# Altium schematic sheet Sheet1.SchDoc
size A
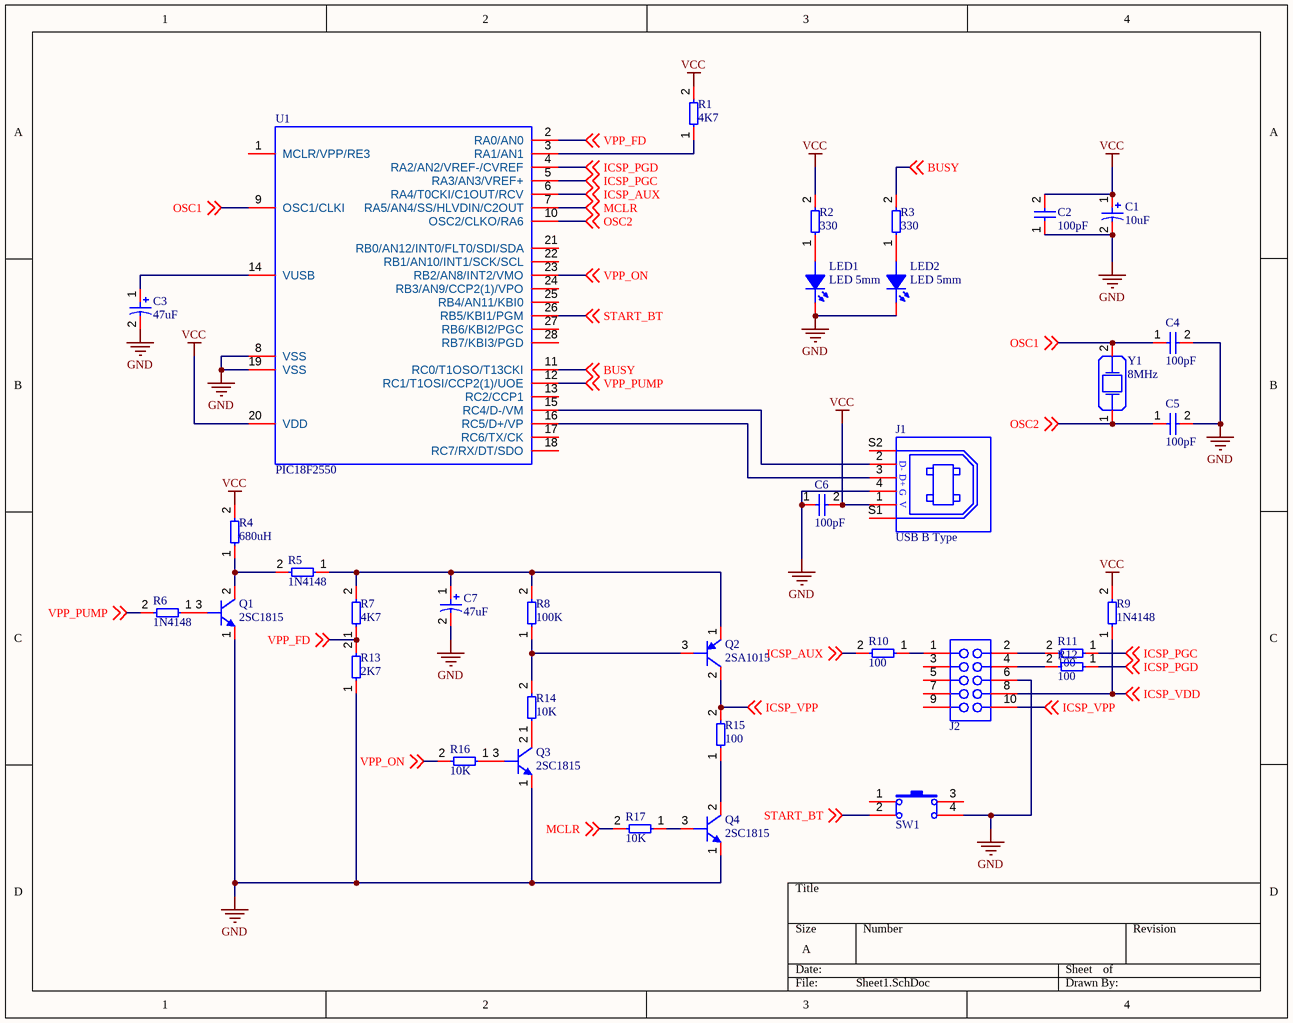
[diagram p0: Sheet1.SchDoc]

## Parts
C1  10uF  [CAP_RAD_4mm]
C2  100pF  [CAP_DISC_PITCH_2.54MM]
C3  47uF  [CAP_RAD_4mm]
C4  100pF  [CAP_DISC_PITCH_2.54MM]
C5  100pF  [CAP_DISC_PITCH_2.54MM]
C6  100pF  [CAP_DISC_PITCH_2.54MM]
C7  47uF  [CAP_RAD_4mm]
J1  USB B Type  [USB-B-TYPE]
J2  Header 5x2 TH Pitch 2.54mm  [Header 5x2 TH Pitch 2.54mm]  (value not drawn)
LED1  LED 5mm  [LED_5MM]
LED2  LED 5mm  [LED_5MM]
Q1  2SC1815  [TO-92]
Q2  2SA1015  [TO-92]
Q3  2SC1815  [TO-92]
Q4  2SC1815  [TO-92]
R1  4K7  [RES-0.25W-H-MF]
R2  330  [RES-0.25W-H-MF]
R3  330  [RES-0.25W-H-MF]
R4  680uH  [RES-0.5W-HH-MF]
R5  1N4148  [RES-0.25W-H-MF]
R6  1N4148  [RES-0.25W-H-MF]
R7  4K7  [RES-0.25W-H-MF]
R8  100K  [RES-0.25W-H-MF]
R9  1N4148  [RES-0.25W-H-MF]
R10  100  [RES-0.25W-H-MF]
R11  100  [RES-0.25W-H-MF]
R12  100  [RES-0.25W-H-MF]
R13  2K7  [RES-0.25W-H-MF]
R14  10K  [RES-0.25W-H-MF]
R15  100  [RES-0.25W-H-MF]
R16  10K  [RES-0.25W-H-MF]
R17  10K  [RES-0.25W-H-MF]
SW1  Button Hole  [BUTTON_HOLE_5.0mm]  (value not drawn)
U1  PIC18F2550  [DIP28_M04]
Y1  8MHz  [HC-49S]

## Nets
GND: C1.2 C2.1 C3.2 C4.2 C5.2 C6.1 C7.2 J1.4 J2.6 LED1.2(K) LED2.2(K) Q1.1(E) Q3.1(E) Q4.1(E) R13.1 SW1.4 U1.8(VSS) U1.19(VSS)
VCC: C1.1 C2.2 C6.2 J1.1 R1.2 R2.2 R4.2 R9.2 U1.20(VDD)
BUSY: R3.2 U1.11(RC0/T1OSO/T13CKI) ; off-sheet BUSY
ICSP_AUX: R10.2 U1.6(RA4/T0CKI/C1OUT/RCV) ; off-sheet ICSP_AUX
ICSP_PGC: R11.1 U1.5(RA3/AN3/VREF+) ; off-sheet ICSP_PGC
ICSP_PGD: R12.1 U1.4(RA2/AN2/VREF-/CVREF) ; off-sheet ICSP_PGD
ICSP_VDD: J2.8 R9.1 ; off-sheet ICSP_VDD
ICSP_VPP: J2.10 Q2.2(C) R15.2 ; off-sheet ICSP_VPP
MCLR: R17.2 U1.7(RA5/AN4/SS/HLVDIN/C2OUT) ; off-sheet MCLR
OSC1: C4.1 U1.9(OSC1/CLKI) Y1.2 ; off-sheet OSC1
OSC2: C5.1 U1.10(OSC2/CLKO/RA6) Y1.1 ; off-sheet OSC2
START_BT: SW1.2 U1.26(RB5/KBI1/PGM) ; off-sheet START_BT
VPP_FD: R7.1 R13.2 U1.2(RA0/AN0) ; off-sheet VPP_FD
VPP_ON: R16.2 U1.23(RB2/AN8/INT2/VMO) ; off-sheet VPP_ON
VPP_PUMP: R6.2 U1.12(RC1/T1OSI/CCP2(1)/UOE) ; off-sheet VPP_PUMP
NetC3_1: C3.1 U1.14(VUSB)
NetC7_1: C7.1 Q2.1(E) R5.1 R7.2 R8.2
NetJ1_2: J1.2 U1.15(RC4/D-/VM)
NetJ1_3: J1.3 U1.16(RC5/D+/VP)
NetJ2_1: J2.1 R10.1
NetJ2_2: J2.2 R11.2
NetJ2_4: J2.4 R12.2
NetLED1_1: LED1.1(A) R2.1
NetLED2_1: LED2.1(A) R3.1
NetQ1_2: Q1.2(C) R4.1 R5.2
NetQ1_3: Q1.3(B) R6.1
NetQ2_3: Q2.3(B) R8.1 R14.2
NetQ3_2: Q3.2(C) R14.1
NetQ3_3: Q3.3(B) R16.1
NetQ4_2: Q4.2(C) R15.1
NetQ4_3: Q4.3(B) R17.1
NetR1_1: R1.1 U1.3(RA1/AN1)

Not connected (* = marked no-connect by the designer): J1 S1 S2; J2 3 5 7 9; SW1 1 3; U1 1(MCLR/VPP/RE3) 13(RC2/CCP1) 17(RC6/TX/CK) 18(RC7/RX/DT/SDO) 21(RB0/AN12/INT0/FLT0/SDI/SDA) 22(RB1/AN10/INT1/SCK/SCL) 24(RB3/AN9/CCP2(1)/VPO) 25(RB4/AN11/KBI0) 27(RB6/KBI2/PGC) 28(RB7/KBI3/PGD)

## Notes on the sheet
- (in symbol USB B Type) D-; D+; G; V

## Library data of the parts
C1 C3 C7 = Capacitor(Radian)
C2 C4-C6 = Capacitors(Disc)
Q1 Q3 Q4 = 2SC1815 (TO-92)
Q2 = 2SA1015 (TO-92)
R1-R17 = Resistors THD
Y1 = Crystal